# EAGLE design mapleCUx_med_018 (EAGLE 7.3.0)
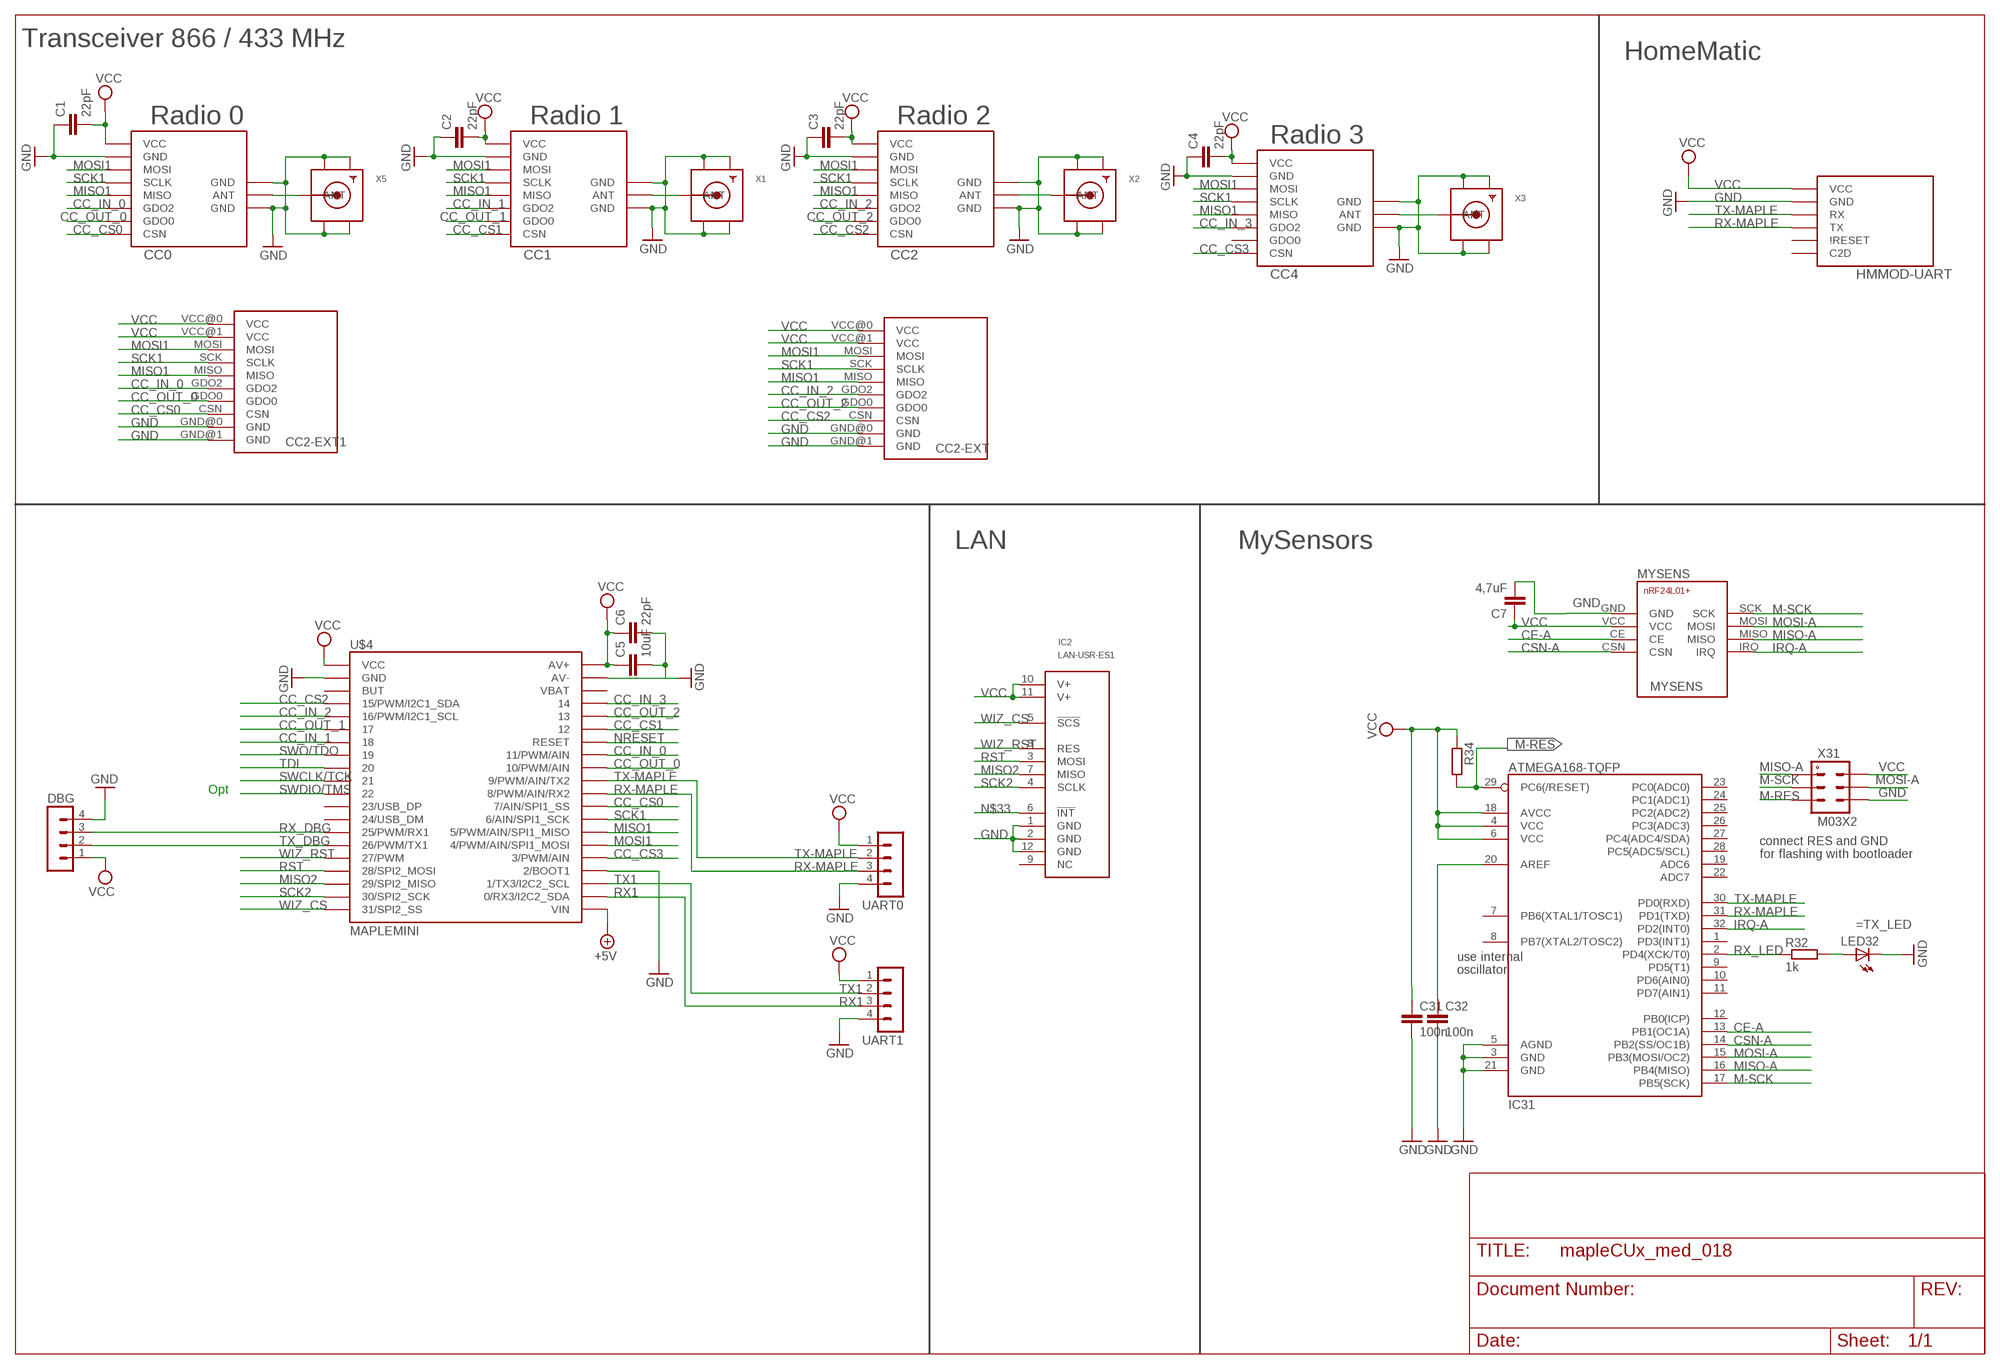
[diagram p0: schematic, sheet 1]

## Parts
C1  22pF  C-EUC0805  [C0805]
C2  22pF  C-EUC0805  [C0805]
C3  22pF  C-EUC0805  [C0805]
C4  22pF  C-EUC0805  [C0805]
C5  10uF  C-EUC1210  [C1210]
C6  22pF  C-EUC0805  [C0805]
C7  4,7uF  C-EUC1210  [C1210]
C31  100n  C-EUC0805  [C0805]
C32  100n  C-EUC0805  [C0805]
CC0  CC1101  CC1101_MODULE1SMD  [CC1101_MODULE1_SMD]
CC1  CC1101_MODULE1SMD  [CC1101_MODULE1_SMD]
CC2  CC1101_MODULE1SMD  [CC1101_MODULE1_SMD]
CC2-EXT  CC1101_MODULE3_DIL  [CC1101_MODULE3_DIL]
CC2-EXT1  CC1101_MODULE3_DIL  [CC1101_MODULE3_DIL]
CC4  CC1101_MODULE1SMD  [CC1101_MODULE1_SMD]
DBG  MA04-1  [MA04-1]
HMMOD-UART  HM-MOD-UARTDIL  [HM-MOD-UART-DIL]
IC2  LAN-USR-ES1  [USR-ES1]
IC31  ATMEGA168-TQFP  [TQFP32-08]
LED32  LEDCHIPLED_0805  [CHIPLED_0805]
MYSENS  NRF24L01+SMD  [NRF24L01+SMD]
R32  1k  R-EU_R0805  [R0805]
R34  R-EU_R0805  [R0805]
U$4  MAPLEMINI  [20-DIP]
UART0  MA04-1  [MA04-1]
UART1  MA04-1  [MA04-1]
X1  SMACONNECTOR_EDGE_UFL  [SMA_EDGELAUNCH_UFL]
X2  SMACONNECTOR_EDGE_UFL  [SMA_EDGELAUNCH_UFL]
X3  SMACONNECTOR_EDGE_UFL  [SMA_EDGELAUNCH_UFL]
X5  SMACONNECTOR_EDGE_UFL  [SMA_EDGELAUNCH_UFL]
X31  M03X2  [2X03-1.27MM_SMD]

## Nets
+5V: U$4.21(VIN)
CC_CS0: CC0.CSN CC2-EXT1.CSN U$4.29(7/AIN/SPI1_SS)
CC_CS1: CC1.CSN U$4.35
CC_CS2: CC2-EXT.CSN CC2.CSN U$4.4(15/PWM/I2C1_SDA)
CC_CS3: CC4.CSN U$4.25(3/PWM/AIN)
CC_IN_0: CC0.GDO2 CC2-EXT1.GDO2 U$4.33(11/PWM/AIN)
CC_IN_1: CC1.GDO2 U$4.7
CC_IN_2: CC2-EXT.GDO2 CC2.GDO2 U$4.5(16/PWM/I2C1_SCL)
CC_IN_3: CC4.GDO2 U$4.37
CC_OUT_0: CC0.GDO0 CC2-EXT1.GDO0 U$4.32(10/PWM/AIN)
CC_OUT_1: CC1.GDO0 U$4.6
CC_OUT_2: CC2-EXT.GDO0 CC2.GDO0 U$4.36
CE-A: IC31.13(PB1(OC1A)) MYSENS.CE
CSN-A: IC31.14(PB2(SS/OC1B)) MYSENS.CSN
GND [PWR]: C1.1 C2.1 C3.1 C4.1 C5.2 C6.2 C7.2 C31.2 C32.2 CC0.GND@0(GND) CC0.GND@1(GND) CC0.GND@2(GND) CC1.GND@0(GND) CC1.GND@1(GND) CC1.GND@2(GND) CC2-EXT1.GND@0(GND) CC2-EXT1.GND@1(GND) CC2-EXT.GND@0(GND) CC2-EXT.GND@1(GND) CC2.GND@0(GND) CC2.GND@1(GND) CC2.GND@2(GND) CC4.GND@0(GND) CC4.GND@1(GND) CC4.GND@2(GND) DBG.4 HMMOD-UART.2(GND) IC2.1(GND) IC2.2(GND) IC2.12(GND) IC31.3(GND) IC31.5(AGND) IC31.21(GND) LED32.C MYSENS.GND U$4.2(GND) U$4.24(2/BOOT1) U$4.39(AV-) UART0.4 UART1.4 X1.GND@1(GND1) X1.GND@2(GND2) X1.GND@3(GND3) X1.GND@4(GND4) X2.GND@1(GND1) X2.GND@2(GND2) X2.GND@3(GND3) X2.GND@4(GND4) X3.GND@1(GND1) X3.GND@2(GND2) X3.GND@3(GND3) X3.GND@4(GND4) X5.GND@1(GND1) X5.GND@2(GND2) X5.GND@3(GND3) X5.GND@4(GND4) X31.P$6
IRQ-A: IC31.32(PD2(INT0)) MYSENS.IRQ
M-RES: IC31.29(PC6(/RESET)) R34.2 X31.P$5
M-SCK: IC31.17(PB5(SCK)) MYSENS.SCK X31.P$3
MISO1: CC0.MISO CC1.MISO CC2-EXT1.MISO CC2-EXT.MISO CC2.MISO CC4.MISO U$4.27(5/PWM/AIN/SPI1_MISO)
MISO2: IC2.7(MISO) U$4.18(29/SPI2_MISO)
MISO-A: IC31.16(PB4(MISO)) MYSENS.MISO X31.P$1
MOSI1: CC0.MOSI CC1.MOSI CC2-EXT1.MOSI CC2-EXT.MOSI CC2.MOSI CC4.MOSI U$4.26(4/PWM/AIN/SPI1_MOSI)
MOSI-A: IC31.15(PB3(MOSI/OC2)) MYSENS.MOSI X31.P$4
N$1: CC1.ANT X1.P(ANT)
N$2: CC4.ANT X3.P(ANT)
N$3: CC2.ANT X2.P(ANT)
N$4: CC0.ANT X5.P(ANT)
N$5: LED32.A R32.2
N$15: C32.1 IC31.20(AREF)
N$33: IC2.6(!INT!)
NRESET: U$4.34(RESET)
RST: IC2.3(MOSI) U$4.17(28/SPI2_MOSI)
RX1: U$4.22(0/RX3/I2C2_SDA) UART1.3
RX-MAPLE: HMMOD-UART.5(TX) IC31.31(PD1(TXD)) U$4.30(8/PWM/AIN/RX2) UART0.3
RX_DBG: DBG.3 U$4.14(25/PWM/RX1)
RX_LED: IC31.2(PD4(XCK/T0)) R32.1
SCK1: CC0.SCLK CC1.SCLK CC2-EXT1.SCK(SCLK) CC2-EXT.SCK(SCLK) CC2.SCLK CC4.SCLK U$4.28(6/AIN/SPI1_SCK)
SCK2: IC2.4(SCLK) U$4.19(30/SPI2_SCK)
SWCLK/TCK: U$4.10
SWDIO/TMS: U$4.11
SWO/TDO: U$4.8
TDI: U$4.9
TX1: U$4.23(1/TX3/I2C2_SCL) UART1.2
TX-MAPLE: HMMOD-UART.6(RX) IC31.30(PD0(RXD)) U$4.31(9/PWM/AIN/TX2) UART0.2
TX_DBG: DBG.2 U$4.15(26/PWM/TX1)
VCC [PWR]: C1.2 C2.2 C3.2 C4.2 C5.1 C6.1 C7.1 C31.1 CC0.VCC CC1.VCC CC2-EXT1.VCC@0(VCC) CC2-EXT1.VCC@1(VCC) CC2-EXT.VCC@0(VCC) CC2-EXT.VCC@1(VCC) CC2.VCC CC4.VCC DBG.1 HMMOD-UART.1(VCC) IC2.10(V+) IC2.11(V+) IC31.4(VCC) IC31.6(VCC) IC31.18(AVCC) MYSENS.VCC R34.1 U$4.1(VCC) U$4.40(AV+) UART0.1 UART1.1 X31.P$2
WIZ_CS: IC2.5(!SCS!) U$4.20(31/SPI2_SS)
WIZ_RST: IC2.8(RES) U$4.16(27/PWM)
Unconnected: CC4.GDO0 HMMOD-UART.3(C2D) HMMOD-UART.4(\!RESET) IC2.9(NC) IC31.1(PD3(INT1)) IC31.7(PB6(XTAL1/TOSC1)) IC31.8(PB7(XTAL2/TOSC2)) IC31.9(PD5(T1)) IC31.10(PD6(AIN0)) IC31.11(PD7(AIN1)) IC31.12(PB0(ICP)) IC31.19(ADC6) IC31.22(ADC7) IC31.23(PC0(ADC0)) IC31.24(PC1(ADC1)) IC31.25(PC2(ADC2)) IC31.26(PC3(ADC3)) IC31.27(PC4(ADC4/SDA)) IC31.28(PC5(ADC5/SCL)) U$4.3(BUT) U$4.12(23/USB_DP) U$4.13(24/USB_DM) U$4.38(VBAT)

## Notes on the sheet
- Transceiver 866 / 433 MHz
- HomeMatic
- Radio 0 | Radio 1 | Radio 2
- Radio 3
- LAN | MySensors
- Opt
- connect RES and GND
- for flashing with bootloader
- =TX_LED
- use internal
- oscillator

## Library data of the parts
C1-C7 C31 C32 = rcl:C-EU: CAPACITOR, European symbol
CC0 CC1 CC2 CC4 = wireless:CC1101_MODULE1: CC1101 wireless module for 433/868 MHz (sold from Aliexpress). DIL version for mounting with pin header (and SMD soldering) and SMD only variant available.
CC2-EXT CC2-EXT1 = wireless:CC1101_MODULE3_DIL: 433 Mhz CC1101 wireless module named RF1101SE V3.1 package special has only limited silk screen on tPlace layer
DBG UART0 UART1 = con-lstb:MA04-1: PIN HEADER; OC_FARNELL: unknown; OC_NEWARK: unknown
HMMOD-UART = wireless:HM-MOD-UART: eQ3 HM-MOD-UART-AW-SH2 wireless module for 868 MHz. DIL version for mounting with pin header (antenna upwards) and SMD variant available (antenna downwards).
IC2 = Martin-Communication:LAN-USR-ES1
IC31 = atmel:ATMEGA168: Atmel Atmega 168/328/328P
LED32 = led:LED: LED OSRAM: - CHIPLED LG R971, LG N971, LY N971, LG Q971, LY Q971, LO R971, LY R971 LH N974, LH R974 LS Q976, LO Q976, LY Q976 LO Q996 - Hyper CHIPLED LW Q18S LB Q993, LB Q99A, LB R99A - SideLED LS A670, LO A670, LY A670, LG A670, LP A670 LB A673, LV A673, LT A673, LW A673 LH A674 LY A675 LS A676, LA A676, LO A676, LY A676, LW A676 LS A679, LY A679, LG A679 - Hyper Micro SIDELED® LS Y876, LA Y876, LO Y876, LY Y876 LT Y87S - SmartLED LW L88C, LW L88S LB L89C, LB L89S, LG L890 LS L89K, LO L89K, LY L89K LS L896, LA L896, LO L896, LY L896 - TOPLED LS T670, LO T670, LY T670, LG T670, LP T670 LSG T670, LSP T670, LSY T670, LOP T670, LYG T670 LG T671, LOG T671, LSG T671 LB T673, LV T673, LT T673, LW T673 LH T674 LS T676, LA T676, LO T676, LY T676, LB T676, LH T676, LSB T676, LW T676 LB T67C, LV T67C, LT T67C, LS T67K, LO T67K, LY T67K, LW E67C LS E67B, LA E67B, LO E67B, LY E67B, LB E67C, LV E67C, LT E67C LW T67C LS T679, LY T679, LG T679 LS T770, LO T770, LY T770, LG T770, LP T770 LB T773, LV T773, LT T773, LW T773 LH T774 LS E675, LA E675, LY E675, LS T675 LS T776, LA T776, LO T776, LY T776, LB T776 LHGB T686 LT T68C, LB T68C - Hyper Mini TOPLED® LB M676 - Mini TOPLED Santana® LG M470 LS M47K, LO M47K, LY M47K Source: http://www.osram.convergy.de LUXEON: - LUMILED® LXK2-PW12-R00, LXK2-PW12-S00, LXK2-PW14-U00, LXK2-PW14-V00 LXK2-PM12-R00, LXK2-PM12-S00, LXK2-PM14-U00 LXK2-PE12-Q00, LXK2-PE12-R00, LXK2-PE12-S00, LXK2-PE14-T00, LXK2-PE14-U00 LXK2-PB12-K00, LXK2-PB12-L00, LXK2-PB12-M00, LXK2-PB14-N00, LXK2-PB14-P00, LXK2-PB14-Q00 LXK2-PR12-L00, LXK2-PR12-M00, LXK2-PR14-Q00, LXK2-PR14-R00 LXK2-PD12-Q00, LXK2-PD12-R00, LXK2-PD12-S00 LXK2-PH12-R00, LXK2-PH12-S00 LXK2-PL12-P00, LXK2-PL12-Q00, LXK2-PL12-R00 Source: www.luxeon.com KINGBRIGHT: KA-3528ASYC Source: www.kingbright.com
MYSENS = wireless:NRF24L01+: nRF24L01+ Transceiver Module
R32 R34 = rcl:R-EU_: RESISTOR, European symbol
U$4 = maplemini-mall:MAPLEMINI
X1-X3 X5 = adafruit:SMACONNECTOR: SMA Connector 90° DIP SMA Connector, 50 Ohm (4UConnector: 07259)
X31 = mechanics:M03X2

## Net classes
0 default: width 0.305 mm
1 PWR: width 0.457 mm

## Board
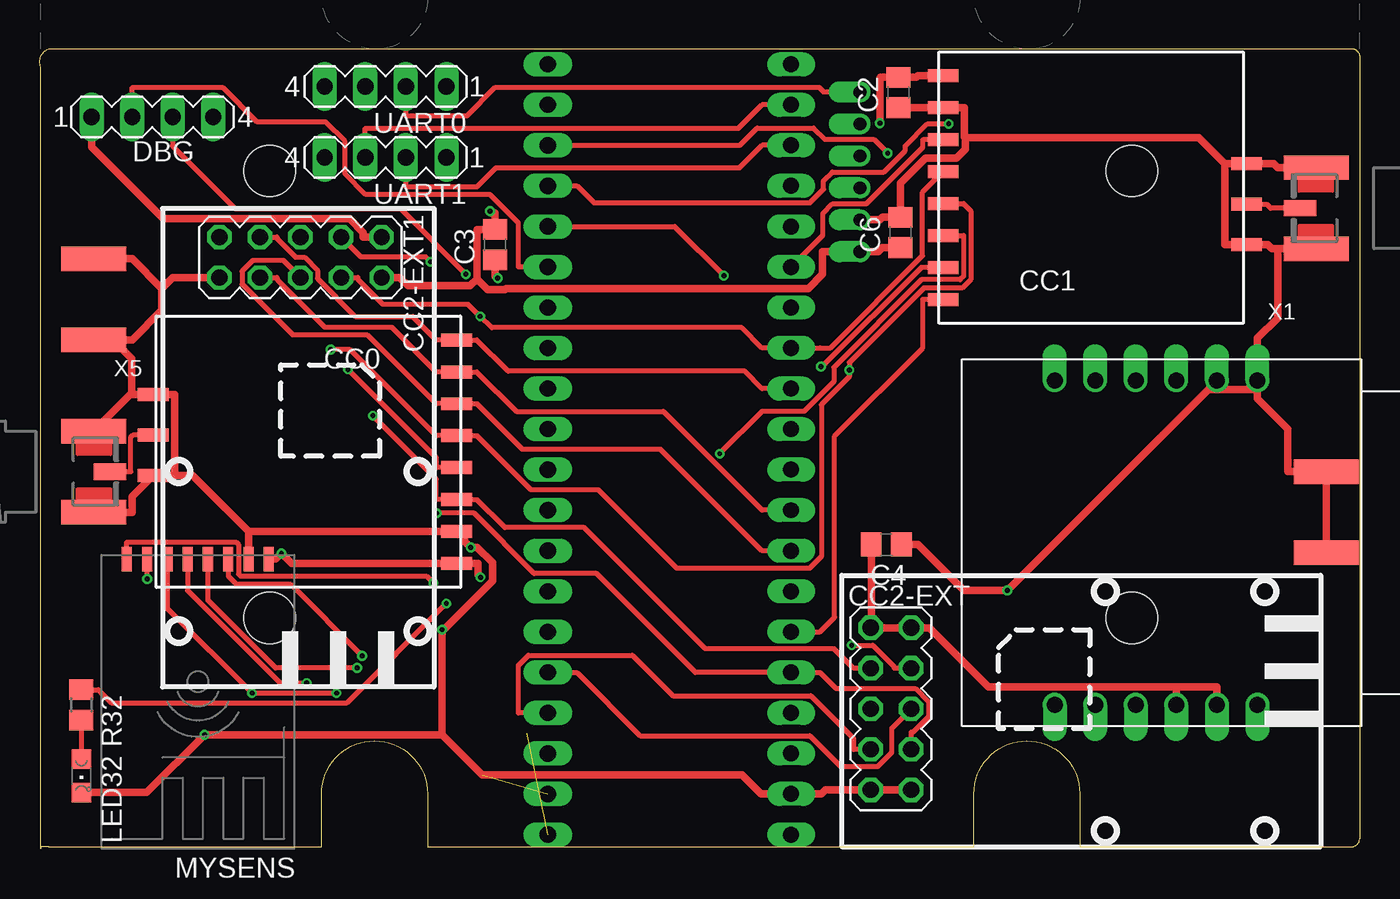
[diagram p1: board, top side]
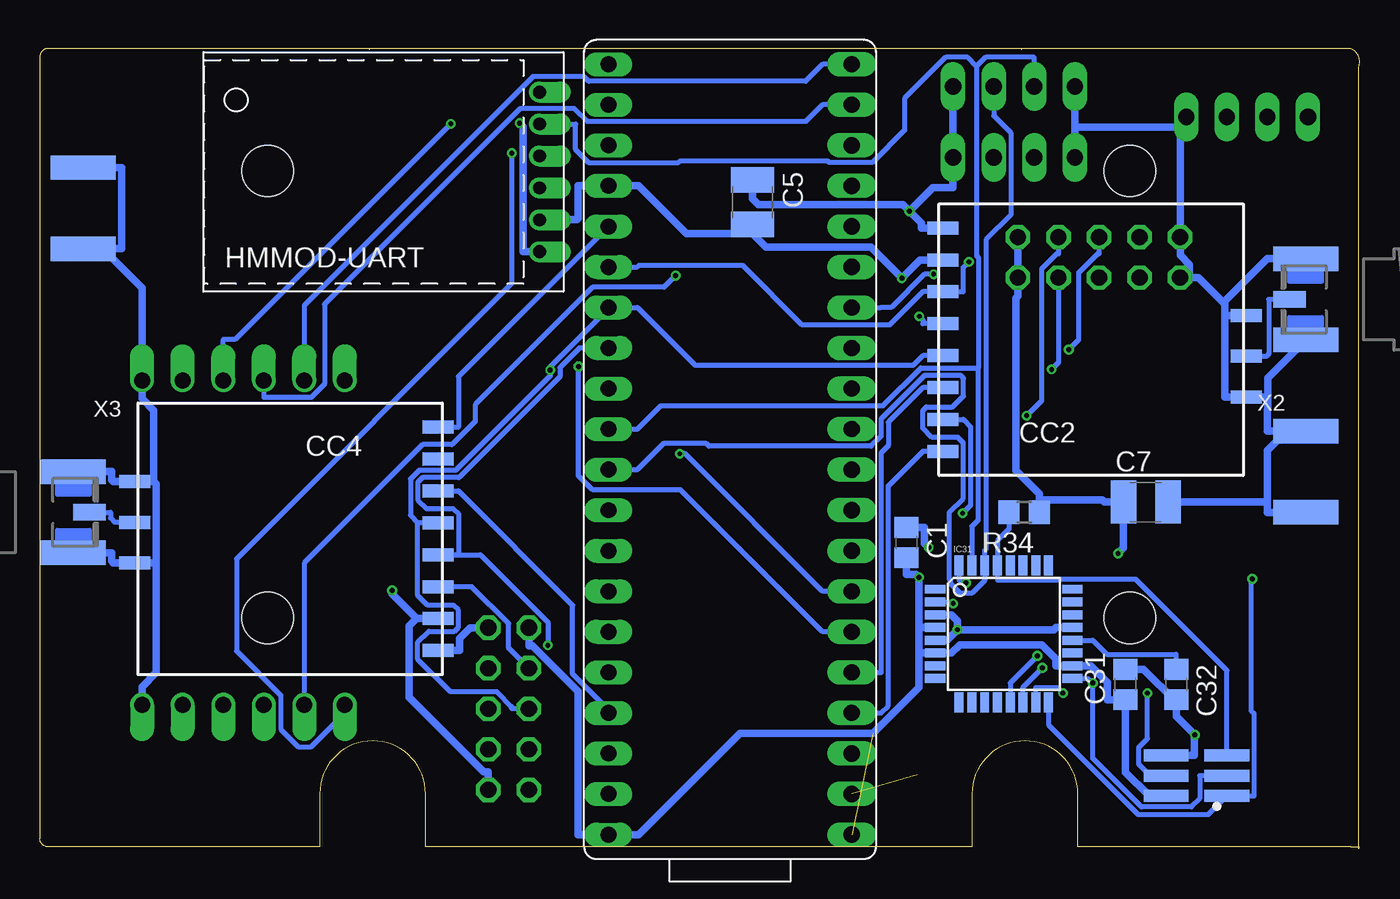
[diagram p2: board, bottom side, seen from below]

Size 82.66 x 50.13 mm. Coordinates in mm from the lower left corner, seen from the top.
Outline: 61.8,6.76 arc90 58.5,3.46 58.5,0.14 24.27,0.14 24.27,3.46 arc90 20.97,6.76 20.94,6.76 arc90 17.64,3.46 17.64,0.14 0.56,0.14 0.06,0.14 0.06,0 0.06,49 arc-90 0.56,50.13 82.16,50.13 arc-90 82.66,49.63 82.66,0.64 arc-90 82.16,0.14 65.13,0.14 65.13,3.46 arc90 61.83,6.76
Outline: 21.17,50.1 21.14,50.1
Outline: 62.03,50.1 62,50.1
Copper layers (1*16): Top 0.035mm / dielectric 1.5mm / Bottom 0.035mm
Design rules "SeeedStudio_2layer_DRU_no_angle_20140221": minimum track width 6mil, minimum drill 12mil, track to track 6mil, track to pad 6mil, pad to pad 6mil, via to via 6mil, smd to smd 0mil, copper to edge 10mil, drill to drill 10mil, minimum pad ring 10mil, minimum via ring 6mil, stop-mask expansion 2mil, vias tented up to drill 100mil, thermal gap 10mil
Holes 3.2 mm at 14.39,14.46 14.39,42.46 68.39,42.46 68.39,14.46
tRestrict: area 17.3,-0.1 to 24.2,6.7; area 58.5,-0.1 to 65.3,6.7
bRestrict: area 17.3,-0.1 to 24.2,6.7; area 58.5,-0.1 to 65.3,6.7

### Footprints (pad centres in the part's own frame; a part is rotated, then mirrored left to right if it is on the bottom)
C0805 = smd 1.3 x 1.5: 1 -0.95,0; 2 0.95,0
C1210 = smd 1.6 x 2.7: 1 -1.4,0; 2 1.4,0
CC1101_MODULE1_SMD = smd 1.93 x 0.813: ANT 19,5.96; CSN 0,0; GDO0 0,2; GDO2 0,4; GND@0 0,12; GND@1 19,8.5; GND@2 19,3.42; MISO 0,6; MOSI 0,10; SCLK 0,8; VCC 0,14
CC1101_MODULE3_DIL = drill 1.016 octagon: CSN 1.81,6.1; GDO0 4.35,6.1; GDO2 4.35,8.64; GND@0 1.81,3.56; GND@1 4.35,3.56; MISO 1.81,8.64; MOSI 1.81,11.18; SCK 4.35,11.18; VCC@0 1.81,13.72; VCC@1 4.35,13.72
MA04-1 = drill 1.016 long: 1 -3.81,0; 2 -1.27,0; 3 1.27,0; 4 3.81,0
HM-MOD-UART-DIL = drill 0.8 offset: 1 0,12; 2 0,10; 3 0,8; 4 0,6; 5 0,4; 6 0,2
USR-ES1 = drill 1 pad 1.35 offset: 1 -10.16,5.715; 2 -10.16,3.175; 3 -10.16,0.635; 4 -10.16,-1.905; 5 -10.16,-4.445; 6 -10.16,-6.985; 7 10.16,-6.985; 8 10.16,-4.445; 9 10.16,-1.905; 10 10.16,0.635; 11 10.16,3.175; 12 10.16,5.715
TQFP32-08 = smd 1.27 x 0.559: 1 -4.293,2.8; 2 -4.293,2; 3 -4.293,1.2; 4 -4.293,0.4; 5 -4.293,-0.4; 6 -4.293,-1.2; 7 -4.293,-2; 8 -4.293,-2.8; 17 4.293,-2.8; 18 4.293,-2; 19 4.293,-1.2; 20 4.293,-0.4; 21 4.293,0.4; 22 4.293,1.2; 23 4.293,2; 24 4.293,2.8 | smd 0.559 x 1.27: 9 -2.8,-4.293; 10 -2,-4.293; 11 -1.2,-4.293; 12 -0.4,-4.293; 13 0.4,-4.293; 14 1.2,-4.293; 15 2,-4.293; 16 2.8,-4.293; 25 2.8,4.293; 26 2,4.293; 27 1.2,4.293; 28 0.4,4.293; 29 -0.4,4.293; 30 -1.2,4.293; 31 -2,4.293; 32 -2.8,4.293
CHIPLED_0805 = smd 1.2 x 1.2: A 0,-1.05; C 0,1.05
NRF24L01+SMD = smd 0.635 x 1.524: CE -1.575,-7.861; CSN -0.305,-7.861; GND -2.845,-7.861; IRQ 4.775,-7.861; MISO 3.505,-7.861; MOSI 2.235,-7.861; SCK 0.965,-7.861; VCC -4.115,-7.861
R0805 = smd 1.3 x 1.5: 1 -0.95,0; 2 0.95,0
20-DIP = drill 1.016 pad 1.27 long: 1 -24.13,-7.62; 2 -21.59,-7.62; 3 -19.05,-7.62; 4 -16.51,-7.62; 5 -13.97,-7.62; 6 -11.43,-7.62; 7 -8.89,-7.62; 8 -6.35,-7.62; 9 -3.81,-7.62; 10 -1.27,-7.62; 11 1.27,-7.62; 12 3.81,-7.62; 13 6.35,-7.62; 14 8.89,-7.62; 15 11.43,-7.62; 16 13.97,-7.62; 17 16.51,-7.62; 18 19.05,-7.62; 19 21.59,-7.62; 20 24.13,-7.62 | drill 1 pad 1.27 long: 21 24.13,7.62; 22 21.59,7.62; 23 19.05,7.62; 24 16.51,7.62; 25 13.97,7.62; 26 11.43,7.62; 27 8.89,7.62; 28 6.35,7.62; 29 3.81,7.62; 30 1.27,7.62; 31 -1.27,7.62; 32 -3.81,7.62; 33 -6.35,7.62; 34 -8.89,7.62; 35 -11.43,7.62; 36 -13.97,7.62; 37 -16.51,7.62; 38 -19.05,7.62; 39 -21.59,7.62; 40 -24.13,7.62
SMA_EDGELAUNCH_UFL = smd 4.064 x 1.524: GND@1 2.032,-2.54; GND@2 2.032,2.54 | smd 4.064 x 1.524 bottom: GND@3 2.032,2.54; GND@4 2.032,-2.54 | smd 2.032 x 1.016: P 3.048,0
2X03-1.27MM_SMD = smd 0.75 x 2.8: P$1 -1.27,-1.905; P$2 -1.27,1.905; P$3 0,-1.905; P$4 0,1.905; P$5 1.27,-1.905; P$6 1.27,1.905

### Placement (x,y rotation side)
C1  28.38,19.19 270 bottom
C2  53.78,47.38 90 top
C3  28.51,37.85 90 top
C4  53.02,19.06 180 top
C5  38.03,40.52 270 bottom
C6  53.91,38.62 90 top
C7  13.39,21.73 0 bottom
C31  14.66,10.29 90 bottom
C32  11.49,10.29 270 bottom
CC0  26.09,31.89 180 top
CC1  56.57,34.42 0 top
CC2  26.09,24.9 0 bottom
CC2-EXT  50.22,0.14 0 top
CC2-EXT1  7.68,40.14 270 top
CC4  57.72,26.42 180 bottom
DBG  7.04,45.85 0 top
HMMOD-UART  51.37,49.41 180 bottom
IC2  70.54,19.19 270 top
IC31  22.28,13.47 0 bottom
LED32  2.6,4.58 180 top
MYSENS  10.22,10.29 180 top
R32  2.6,9.03 270 top
R34  21.01,21.09 180 bottom
U$4  39.43,25.03 90 bottom
UART0  21.65,47.76 180 top
UART1  21.65,43.31 180 top
X1  81.97,40.14 180 top
X2  1.33,34.42 180 bottom
X3  82.61,21.09 0 bottom
X5  1.33,23.63 0 top
X31  10.22,4.58 90 bottom

### Tracks (layer width: path | path; a pad name or v marks a point on that pad's centre or on a via)
CC_CS0
  Top 0.305: U$4.29 45.24,28.84 44.15,29.92 29.33,29.92 27.36,31.89 CC0.CSN 24.82,31.89 23.35,33.36 19.75,33.36 17.39,35.73 17.39,36.24 16.57,37.06 16.01,37.06 14.85,38.23 14.85,38.33 CC2-EXT1.CSN
CC_CS1
  Top 0.305: CC1.CSN 55.3,34.42 55.3,31.38 49.78,25.86 49.78,14.51 48.86,13.6 U$4.35
CC_CS2
  Top 0.305: U$4.4 29.98,8.52 29.98,11.51 30.6,12.13 37.11,12.13 39.65,9.59 48.29,9.59 50.97,6.91 50.97,6.23 CC2-EXT.CSN
  Bottom 0.305: CC2.CSN 27.36,24.9 29.52,22.74 29.52,8.97 29.98,8.52 U$4.4
CC_CS3
  Bottom 0.305: CC4.CSN 56.45,26.42 56.45,29.6 U$4.25
CC_IN_0
  Top 0.305: U$4.33 45.24,18.68 38.89,25.03 30.22,25.03 27.36,27.89 CC0.GDO2 24.82,27.89 20.49,32.22 15.82,32.22 12.66,35.38 12.66,36.19 13.33,36.86 15.25,36.86 CC2-EXT1.GDO2
CC_IN_1  (via drill 0.3 pad 0.61)
  Top 0.305: v42.58,24.76 45.23,27.41 47.87,27.41 49.73,29.26 49.73,30.17 55.21,35.65 57.64,35.65 57.84,35.86 57.84,38.42 CC1.GDO2
  Bottom 0.305: U$4.7 33.64,16.14 42.26,24.76 v42.58,24.76
CC_IN_2
  Top 0.305: U$4.5 33.64,11.06 37.6,7.09 48.23,7.09 50.16,5.17 52.49,5.17 53.36,6.04 53.36,7.56 CC2-EXT.GDO2
  Bottom 0.305: CC2.GDO2 27.36,28.9 29.52,26.74 29.52,25.27 29.98,24.81 29.98,11.06 U$4.5
CC_IN_3
  Bottom 0.305: CC4.GDO2 56.45,22.42 49.29,15.27 49.29,10.96 47.05,8.72 U$4.37
CC_OUT_0
  Top 0.305: U$4.32 45.24,21.22 39.05,27.41 29.84,27.41 27.36,29.89 CC0.GDO0 24.82,29.89 22.03,32.68 17.85,32.68 14.85,35.68 14.85,35.79 CC2-EXT1.GDO0
CC_OUT_1  (via drill 0.3 pad 0.61)
  Top 0.305: CC1.GDO0 55.21,36.42 48.99,30.21 v48.93,30.21
  Bottom 0.305: U$4.6 33.64,13.6 42.53,22.49 48.04,22.49 48.93,23.37 v48.93,30.21
CC_OUT_2  (via drill 0.3 pad 0.61)
  Top 0.305: v24.86,21.03 27.18,21.03 30.97,17.25 34.88,17.25 41.06,11.06 U$4.36 48.86,11.06 49.87,10.04 54.83,10.04 55.67,9.21 55.67,8.28 54.69,7.3 54.57,7.3 CC2-EXT.GDO0
  Bottom 0.305: v24.86,21.03 24.37,21.52 24.37,26.44 24.82,26.9 CC2.GDO0
CE-A  (via drill 0.3 pad 0.61)
  Top 0.305: MYSENS.CE 11.79,17.09 12.3,16.59 15.7,16.59 v20.19,12.1
  Bottom 0.305: v20.19,12.1 21.88,10.4 IC31.13
CSN-A  (via drill 0.3 pad 0.61)
  Top 0.305: v19.87,11.33 14.75,11.33 10.52,15.56 MYSENS.CSN
  Bottom 0.305: v19.87,11.33 21.08,10.12 IC31.14
GND  (via drill 0.3 pad 0.61)  (1 unrouted)
  Top 0.457: 25.19,7.14 v10.31,7.14 6.7,3.53 3.58,3.53 LED32.C | 25.19,7.14 27.7,4.63 43.96,4.63 45.16,3.44 U$4.39 48.94,3.44 49.2,3.7 CC2-EXT.GND@0 CC2-EXT.GND@1 | 25.19,7.14 v25.19,13.73 25.28,13.73 28.34,16.78 28.34,17.93 27.38,18.89 v26.99,18.89 26.62,19.26 26.62,19.89 CC0.GND@0 13.06,19.89 | v28.68,35.76 28.57,35.87 28.51,35.87 C3.1 | 73.72,28.78 73.19,28.78 v60.6,16.19 57.87,16.19 55,19.06 C4.1 | 13.06,19.89 9.56,23.39 8.44,23.39 | 13.06,19.89 13.06,19.3 MYSENS.GND | C2.1 54.64,46.43 54.67,46.43 54.91,46.43 54.92,46.42 CC1.GND@0 57.92,46.42 57.92,44.59 57.96,44.55 | IC2.2 73.72,28.78 | 76.26,28.78 76.26,28.21 78.16,26.31 78.16,23.63 X3.GND@2 X3.GND@1 | 76.26,28.78 IC2.1 76.26,31.99 77.53,33.26 77.53,37.6 | 76.26,28.78 73.72,28.78 | 77.53,37.6 77.17,37.6 76.92,37.84 CC1.GND@2 74.23,37.84 74.23,42.92 | 74.23,42.92 72.6,44.55 57.96,44.55 | 74.23,42.92 CC1.GND@1 77.28,42.92 77.53,42.68 X1.GND@1 | X1.GND@2 77.53,37.6 | 57.96,44.55 57.96,43.83 57.4,43.27 55.47,43.27 53.91,41.71 53.91,40.6 C6.2 52.78,39.57 52.62,39.41 HMMOD-UART.2 | 5.75,28.46 5.66,28.46 X5.GND@2 | 4.57,31.89 5.75,30.71 5.75,28.46 | 8.44,23.39 8.44,28.46 CC0.GND@2 5.75,28.46 | 4.57,31.89 5.77,31.89 7.63,33.74 7.63,35.11 | X2.GND@2 4.57,31.89 | 7.63,35.11 5.77,36.96 X2.GND@1 | 7.63,35.11 8.31,35.79 10.67,35.79 CC2-EXT1.GND@1 | 8.44,23.39 CC0.GND@1 5.77,22.07 5.77,21.09 X5.GND@1
  Bottom 0.457: 17.84,45.22 17.84,45.85 UART0.4 | 11.24,45.22 17.84,45.22 | 11.24,45.22 11.24,39.47 CC2-EXT1.GND@0 11.24,37.19 10.67,36.61 10.67,35.79 | DBG.4 11.24,45.47 11.24,45.22 | UART1.4 17.84,45.22 | 10.34,7.14 10.34,7.17 11.49,8.31 11.49,8.93 | 10.34,7.14 10.34,5.85 X31.P$6 | 10.34,7.14 v10.31,7.14 | 5.77,21.73 10.81,21.73 C7.2 | v25.19,13.73 25.19,14.29 25.56,14.67 IC31.3 | v25.19,13.73 19.15,13.73 19.01,13.87 IC31.21 | 38.03,38.53 37.19,37.69 30.6,37.69 v28.68,35.76 27.54,36.9 27.44,36.9 CC2.GND@0 | 38.03,38.53 42.15,38.53 45.16,41.54 46.74,41.54 U$4.24 48.94,41.54 48.94,39.5 49.02,39.41 HMMOD-UART.2 | IC31.5 25.85,13.07 v25.19,13.73 | v60.6,16.19 60.6,15.96 59.06,14.42 | 59.06,14.42 59.53,13.96 59.53,9.5 54.86,4.84 54.57,4.84 CC2-EXT.GND@1 | CC4.GND@0 59.06,14.42 | C31.2 13.53,11.24 11.49,9.2 11.49,8.93 | C32.2 11.49,8.93 | 75.37,17.92 75.37,11.05 76.26,10.16 IC2.12 | C1.1 27.25,20.14 27.25,19.15 v26.99,18.89 | 5.77,21.73 5.77,21.09 X5.GND@1 | 4.57,26.17 5.77,24.96 5.77,21.73 | 4.57,26.17 5.77,26.17 5.77,27.51 5.75,27.53 5.75,28.32 | X5.GND@2 4.57,26.17 | 10.67,35.79 10.1,35.79 8.52,34.22 | CC2-EXT1.GND@1 10.67,35.79 | X2.GND@2 5.75,29.5 5.75,28.32 | 5.75,28.32 CC2.GND@2 8.44,28.32 8.44,33.4 | 8.52,34.22 8.44,34.13 8.44,33.4 | 8.52,34.22 5.77,36.96 X2.GND@1 | C5.2 38.03,38.53 | CC2.GND@1 8.44,33.4 | 75.52,23 75.52,27.47 76.26,28.21 IC2.1 76.26,35.12 78.74,37.6 | 75.52,23 75.37,22.85 75.37,17.92 | 75.52,23 CC4.GND@2 78.06,23 78.16,23.11 78.16,23.63 X3.GND@2 | 75.37,17.92 CC4.GND@1 78.06,17.92 78.16,18.03 78.16,18.55 X3.GND@1 | 78.74,37.6 77.53,37.6 77.53,42.68 X1.GND@1 | X1.GND@2 78.74,37.6
IRQ-A  (via drill 0.3 pad 0.61)
  Top 0.305: v24.65,16.66 24.22,17.09 12.56,17.09 12.44,17.21 12.44,19.06 12.28,19.22 5.44,19.22 MYSENS.IRQ
  Bottom 0.305: v24.65,16.66 24.81,16.82 25.08,16.82 IC31.32
M-RES
  Bottom 0.305: R34.2 21.96,20.04 22.68,19.32 IC31.29 22.68,16.82 18.93,16.82 18.86,16.89 14.03,16.89 8.31,11.18 X31.P$5
M-SCK  (via drill 0.3 pad 0.61)
  Top 0.305: MYSENS.SCK 9.25,16.19 15.05,10.39 v16.71,10.39
  Bottom 0.305: IC31.17 17.05,10.67 16.77,10.39 v16.71,10.39 16.71,5.67 13.67,2.63 10.54,2.63 10.02,3.15 10.02,4.58 X31.P$3
MISO1  (via drill 0.3 pad 0.61)
  Top 0.305: v18.2,31.28 19.43,31.28 24.82,25.89 CC0.MISO 27.36,25.89 30.76,22.49 34.98,22.49 39.89,17.58 48.2,17.58 48.94,18.32 48.94,27.83 50.7,29.59 v50.7,30.01 50.7,30.47 55.37,35.14 57.77,35.14 58.3,35.67 58.3,39.96 57.84,40.42 CC1.MISO
  Bottom 0.305: CC2-EXT1.MISO 16.32,37.26 16.43,37.26 17.59,36.1 17.59,31.9 v18.2,31.28 | 58.99,20.42 59.45,20.89 59.45,23.18 58.92,23.71 56.61,23.71 50.7,29.62 v50.7,30.01 50.7,30.19 46.97,33.92 46.85,33.92 | 46.85,33.92 45.24,33.92 41.62,30.31 27.96,30.31 27.36,30.9 CC2.MISO | U$4.27 46.85,33.92 | 58.99,20.42 58.99,15.88 58.37,15.26 56.75,15.26 56.45,14.96 56.45,13.88 56.69,13.63 58.31,13.63 58.99,12.96 58.99,11.88 56.95,9.84 54.03,9.84 53.1,8.91 53.1,8.78 CC2-EXT.MISO | CC4.MISO 58.99,20.42
MISO2  (via drill 0.3 pad 0.61)
  Top 0.305: U$4.18 43.84,44.08 44.93,45.16 48.45,45.16 49.16,44.45 52.24,44.45 v53.1,43.59
  Bottom 0.305: v53.1,43.59 53.1,35.42 70.35,18.18 70.35,12.4 67.58,9.63 67.58,7.5 66.48,6.4 65.66,6.4 63.56,8.5 IC2.7
MISO-A  (via drill 0.3 pad 0.61)
  Top 0.305: v6.71,16.92 MYSENS.MISO
  Bottom 0.305: v6.71,16.92 6.78,16.86 6.78,8.63 6.61,8.46 6.61,3.31 X31.P$1 9.46,2.16 13.88,2.16 19.48,7.77 IC31.16
MOSI1  (via drill 0.3 pad 0.61)
  Top 0.305: v24.47,36.78 24.17,37.08 20.11,37.08 CC2-EXT1.MOSI | CC1.MOSI 55.3,44.42 55.3,43.96 51.76,40.41 49.65,40.41 49.04,39.8 49.04,38.44 U$4.26 | v20.85,27.14 24.82,23.17 24.82,21.89 CC0.MOSI 27.36,21.89 29.12,20.13 34.08,20.13 41.68,12.54 49.75,12.54 50.97,11.31 51.5,11.31 CC2-EXT.MOSI
  Bottom 0.305: CC2-EXT.MOSI 53.3,12.58 53.3,14.11 55.61,16.42 CC4.MOSI | v24.47,36.78 24.82,36.43 24.82,34.9 CC2.MOSI 26.19,34.9 27.36,34.9 29.43,32.83 34.92,32.83 38.63,36.54 45.15,36.54 45.24,36.46 U$4.26 | CC2-EXT1.MOSI 18.86,37.26 18.99,37.26 19.93,36.33 19.93,28.07 v20.85,27.14
MOSI-A  (via drill 0.3 pad 0.61)
  Top 0.305: v18.58,9.76 v13.28,9.76 7.98,15.06 7.98,17.09 MYSENS.MOSI
  Bottom 0.305: v18.58,9.76 18.93,10.12 20.28,10.12 IC31.15 | X31.P$4 13.11,4.58 13.83,5.3 13.83,6.35 13.28,6.9 v13.28,9.76
N$1
  Top 0.305: CC1.ANT 76.84,40.38 77.09,40.14 X1.P
N$2
  Bottom 0.305: X3.P 78.24,21.09 78.24,20.72 77.99,20.46 CC4.ANT
N$3
  Bottom 0.305: CC2.ANT 5.82,30.86 5.7,30.99 5.7,34.42 X2.P
N$4
  Top 0.305: CC0.ANT 5.82,25.93 5.7,25.8 5.7,23.63 X5.P
N$5
  Top 0.305: R32.2 LED32.A
N$15
  Bottom 0.305: C32.1 11.49,12.2 15.84,12.2 16.71,13.07 IC31.20
RST  (via drill 0.3 pad 0.61)
  Top 0.305: v56.92,45.42 55.59,45.42 54.2,44.03 54.2,43.75 52.86,42.41 49.63,42.41 49.09,41.86 49.09,41.32 48.24,40.47 34.7,40.47 33.64,41.54 U$4.17
  Bottom 0.305: IC2.3 71.18,31.91 70.43,31.91 v56.92,45.42
RX1
  Top 0.305: U$4.22 45.24,46.62 43.76,45.14 20.38,45.14 UART1.3
RX-MAPLE
  Bottom 0.305: 23.99,49.04 23.99,37.16 23.86,37.03 23.86,30.17 23.9,30.13 | 23.9,30.13 23.9,20.59 24.28,20.2 IC31.31 | 23.9,30.13 27.49,30.13 29.85,27.76 43.77,27.76 45.24,26.3 U$4.30 | 23.99,49.04 23.44,49.59 20.38,49.59 UART0.3 | 23.99,49.04 24.54,49.59 25.93,49.59 28.5,47.02 28.5,45.02 30.52,43 33.21,43 33.29,43.08 42.59,43.08 42.7,42.97 48.26,42.97 49.1,43.81 49.1,45.41 HMMOD-UART.5
RX_DBG  (via drill 0.3 pad 0.61)
  Top 0.305: v26.67,36 22.58,40.1 12.24,40.1 8.31,44.03 DBG.3
  Bottom 0.305: v26.67,36 27.25,36 29.34,33.92 29.98,33.92 U$4.14
RX_LED  (via drill 0.3 pad 0.61)
  Top 0.305: v25.45,15.37 19.24,9.15 4.48,9.15 3.65,9.97 R32.1
  Bottom 0.305: v25.45,15.37 25.56,15.47 25.64,15.47 IC31.2
SCK1  (via drill 0.3 pad 0.61)
  Top 0.305: v50.84,12.76 52.18,12.76 53.51,11.42 53.51,11.31 CC2-EXT.SCK | CC2-EXT1.SCK 19.93,35.79 19.93,35.68 21.5,34.11 26.83,34.11 v27.58,33.36 28.29,32.65 43.97,32.65 45.24,31.38 U$4.28 47.96,31.38 48.86,31.38 49.51,31.38 55.29,37.15 55.29,41.14 CC1.SCLK | v19.29,30.04 24.82,24.51 24.82,23.89 CC0.SCLK
  Bottom 0.305: 56.45,18.42 55.07,18.42 50.84,14.2 v50.84,12.76 | 56.45,18.42 56.65,18.42 CC4.SCLK | 56.45,18.42 56.45,21 56.77,21.33 58.45,21.33 58.99,21.86 58.99,22.97 58.7,23.26 56.42,23.26 50.09,29.59 50.09,30.15 48.86,31.38 U$4.28 | CC2.SCLK 27.36,32.9 27.36,33.15 v27.58,33.36 | CC2-EXT1.SCK 18.86,30.47 v19.29,30.04
SCK2
  Bottom 0.305: IC2.4 68.64,28.29 65.66,28.29 64.83,29.11 64.83,34.12 52.57,46.38 49.19,46.38 48.37,45.56 34.7,45.56 33.64,46.62 U$4.19
TX1
  Top 0.305: U$4.23 45.24,44.08 43.83,42.67 28.57,42.67 27.38,41.49 22.92,41.49 UART1.2
TX-MAPLE
  Top 0.305: HMMOD-UART.6 49.1,47.41 48.8,47.71 28.52,47.71 26.75,45.93 22.92,45.93 UART0.2
  Bottom 0.305: U$4.31 45.24,23.76 43.61,25.39 40.91,25.39 40.76,25.23 30.59,25.23 29.98,25.84 29.98,26.94 27.26,29.67 24.98,29.67 24.81,29.49 24.81,28.37 25.49,27.69 27.13,27.69 27.36,27.46 27.36,26.36 26.78,25.77 25.15,25.77 24.82,25.44 24.82,21.96 25.68,21.11 25.68,16.87 25.6,16.79 25.6,16.61 25,16.01 24.3,16.01 23.48,16.82 IC31.30 23.48,18.12 23.48,18.7 23.4,18.78 23.4,38.17 21.85,39.72 21.85,44.86 22.92,45.93 UART0.2
TX_DBG
  Top 0.305: DBG.2 5.77,47.68 11.46,47.68 13.61,45.54 17.91,45.54 19.11,44.34 19.11,42.3 20.42,41 28.19,41 29.98,39.21 29.98,36.46 U$4.15
VCC  (via drill 0.3 pad 0.61)  (1 unrouted)
  Top 0.457: 52.07,13.86 CC2-EXT.VCC@1 55.72,13.86 59.41,10.16 71.18,10.16 | CC2-EXT.VCC@0 52.07,13.86 | 52.07,13.86 C4.2 | 27.38,35.71 28.04,35.04 29.14,35.04 29.21,35.11 48.13,35.11 49.02,36 49.02,37.41 HMMOD-UART.1 52.52,37.41 52.78,37.67 C6.1 | v52.61,45.46 52.61,48.29 52.65,48.33 C2.2 54.91,48.33 55.01,48.42 CC1.VCC | 27.38,35.71 26.95,35.28 23.06,35.28 22.54,35.79 CC2-EXT1.VCC@1 | 27.38,35.71 27.38,38.8 C3.2 28.51,39.84 28.3,39.84 v28.19,39.95 | v27.59,17.01 27.44,17.17 27.44,17.89 CC0.VCC 15.76,17.89 v15.13,18.52 14.77,18.16 MYSENS.VCC | DBG.1 3.23,43.95 7.71,39.47 19.39,39.47 20.26,38.61 20.26,38.33 CC2-EXT1.VCC@0 | IC2.11 73.72,10.16 71.18,10.16 | IC2.10 71.18,10.16
  Bottom 0.457: 20.06,21.86 16.11,21.86 15.98,21.73 C7.1 14.79,18.85 v15.13,18.52 | 20.06,21.86 20.06,22.22 21.54,23.69 21.54,34.51 21.4,34.65 CC2-EXT1.VCC@1 CC2-EXT1.VCC@0 | R34.1 20.06,21.86 | X31.P$2 13.17,3.31 14.66,4.8 C31.1 15.8,9.35 15.8,10.45 16.82,11.47 16.98,11.47 IC31.18 19.01,11.47 19.01,11.89 19.9,12.78 25.05,12.78 25.56,12.27 IC31.6 27.36,12.27 27.59,12.27 | v52.61,45.46 52.4,45.26 52.4,37.41 HMMOD-UART.1 | v28.19,39.95 26.73,41.41 25.46,41.41 UART1.1 UART0.1 | v28.19,39.95 28.6,40.36 37.65,40.36 38.03,40.74 C5.1 | 27.59,13.87 v27.59,17.01 27.78,17.2 28.38,17.2 C1.2 | IC31.4 27.59,13.87 | 27.59,12.27 27.59,13.87 | 27.59,12.27 27.59,10.12 30.47,7.25 38.81,7.25 45.16,0.9 U$4.40 48.94,0.9 48.94,9.85 51.8,12.71 52.03,12.71 CC2-EXT.VCC@0 | CC4.VCC 56.37,12.42 56.37,13.2 55.72,13.86 CC2-EXT.VCC@1 | v28.19,39.95 27.44,39.2 27.44,38.9 CC2.VCC
WIZ_CS
  Bottom 0.305: U$4.20 33.64,49.16 34.71,48.09 48.29,48.09 48.58,48.38 51.77,48.38 66.1,34.05 IC2.5
WIZ_RST  (via drill 0.3 pad 0.61)
  Top 0.305: U$4.16 39.75,39 v42.84,35.91
  Bottom 0.305: v42.84,35.91 43.56,35.19 48.04,35.19 55.4,27.83 55.4,26.77 56.85,25.33 58.68,25.33 66.1,17.9 IC2.8